# Altium schematic sheet SDR_SCHEMATIC.SchDoc
size B; SheetNumber: 2; SheetTotal: 12
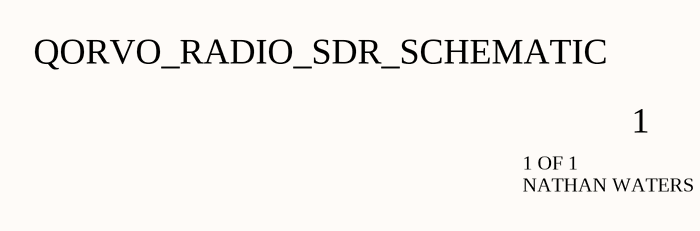
[diagram p0: SDR_SCHEMATIC.SchDoc]

## Notes on the sheet
- QORVO_RADIO_SDR_SCHEMATIC
- 1 OF 1
- 1
- NATHAN WATERS